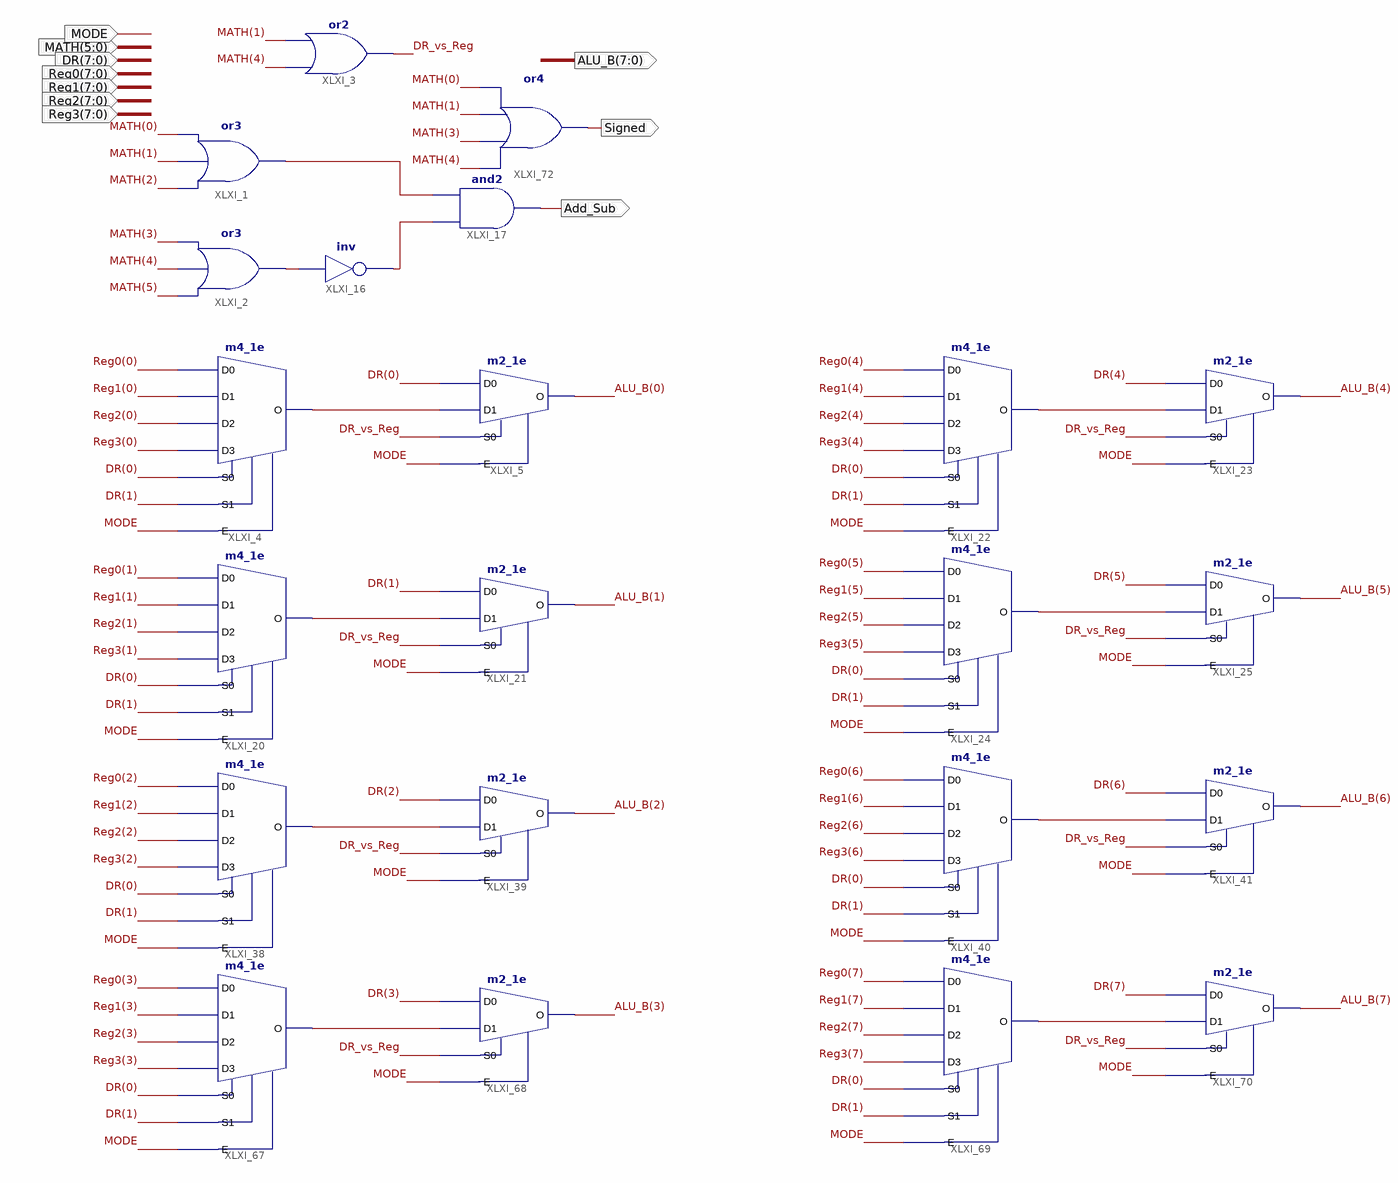
[diagram p0: schematic sheet 1]
// Xilinx ISE schematic CU_ALU.sch (spartan3e) as structural Verilog: 22 symbols, 10 ports
module CU_ALU (
  input  MODE,
  input  [5:0] MATH,
  input  [7:0] DR,
  input  [7:0] Reg0,
  input  [7:0] Reg1,
  input  [7:0] Reg2,
  input  [7:0] Reg3,
  output Add_Sub,
  output Signed,
  output [7:0] ALU_B
);

  wire DR_vs_Reg, XLXN_2, XLXN_21, XLXN_22, XLXN_23, XLXN_49, XLXN_60, XLXN_71, XLXN_148, XLXN_159, XLXN_305,
       XLXN_316;

  or XLXI_1 (XLXN_23, MATH[2], MATH[1], MATH[0]);
  or XLXI_2 (XLXN_21, MATH[5], MATH[4], MATH[3]);
  not XLXI_16 (XLXN_22, XLXN_21);
  and XLXI_17 (Add_Sub, XLXN_22, XLXN_23);
  m4_1e XLXI_4 (.D0(Reg0[0]), .D1(Reg1[0]), .D2(Reg2[0]), .D3(Reg3[0]), .E(MODE), .S0(DR[0]), .S1(DR[1]), .O(XLXN_2));
  m2_1e XLXI_5 (.D0(DR[0]), .D1(XLXN_2), .E(MODE), .S0(DR_vs_Reg), .O(ALU_B[0]));
  m4_1e XLXI_20 (.D0(Reg0[1]), .D1(Reg1[1]), .D2(Reg2[1]), .D3(Reg3[1]), .E(MODE), .S0(DR[0]), .S1(DR[1]), .O(XLXN_49));
  m2_1e XLXI_21 (.D0(DR[1]), .D1(XLXN_49), .E(MODE), .S0(DR_vs_Reg), .O(ALU_B[1]));
  m4_1e XLXI_38 (
    .D0(Reg0[2]), .D1(Reg1[2]), .D2(Reg2[2]), .D3(Reg3[2]), .E(MODE), .S0(DR[0]), .S1(DR[1]), .O(XLXN_148));
  m2_1e XLXI_39 (.D0(DR[2]), .D1(XLXN_148), .E(MODE), .S0(DR_vs_Reg), .O(ALU_B[2]));
  m4_1e XLXI_67 (
    .D0(Reg0[3]), .D1(Reg1[3]), .D2(Reg2[3]), .D3(Reg3[3]), .E(MODE), .S0(DR[0]), .S1(DR[1]), .O(XLXN_305));
  m2_1e XLXI_68 (.D0(DR[3]), .D1(XLXN_305), .E(MODE), .S0(DR_vs_Reg), .O(ALU_B[3]));
  m4_1e XLXI_22 (.D0(Reg0[4]), .D1(Reg1[4]), .D2(Reg2[4]), .D3(Reg3[4]), .E(MODE), .S0(DR[0]), .S1(DR[1]), .O(XLXN_60));
  m2_1e XLXI_23 (.D0(DR[4]), .D1(XLXN_60), .E(MODE), .S0(DR_vs_Reg), .O(ALU_B[4]));
  m4_1e XLXI_24 (.D0(Reg0[5]), .D1(Reg1[5]), .D2(Reg2[5]), .D3(Reg3[5]), .E(MODE), .S0(DR[0]), .S1(DR[1]), .O(XLXN_71));
  m2_1e XLXI_25 (.D0(DR[5]), .D1(XLXN_71), .E(MODE), .S0(DR_vs_Reg), .O(ALU_B[5]));
  m4_1e XLXI_40 (
    .D0(Reg0[6]), .D1(Reg1[6]), .D2(Reg2[6]), .D3(Reg3[6]), .E(MODE), .S0(DR[0]), .S1(DR[1]), .O(XLXN_159));
  m2_1e XLXI_41 (.D0(DR[6]), .D1(XLXN_159), .E(MODE), .S0(DR_vs_Reg), .O(ALU_B[6]));
  m4_1e XLXI_69 (
    .D0(Reg0[7]), .D1(Reg1[7]), .D2(Reg2[7]), .D3(Reg3[7]), .E(MODE), .S0(DR[0]), .S1(DR[1]), .O(XLXN_316));
  m2_1e XLXI_70 (.D0(DR[7]), .D1(XLXN_316), .E(MODE), .S0(DR_vs_Reg), .O(ALU_B[7]));
  or XLXI_3 (DR_vs_Reg, MATH[4], MATH[1]);
  or XLXI_72 (Signed, MATH[4], MATH[3], MATH[1], MATH[0]);
endmodule
